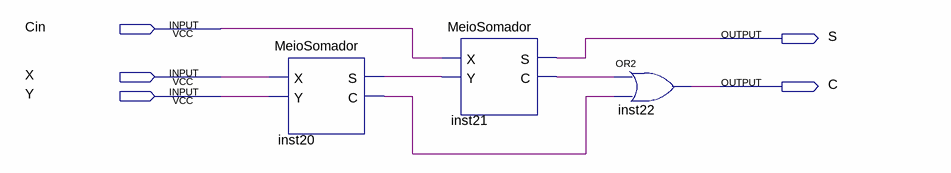
[diagram p0: schematic sheet]
// Quartus schematic SomadorCompleto.bdf as structural Verilog: 3 symbols, 5 pins
module SomadorCompleto (
  input  Cin,
  input  X,
  input  Y,
  output S,
  output C
);

  wire inst20_c, inst20_s, inst21_c;

  MeioSomador inst20 (.X(X), .Y(Y), .S(inst20_s), .C(inst20_c));
  MeioSomador inst21 (.X(Cin), .Y(inst20_s), .S(S), .C(inst21_c));
  or inst22 (C, inst21_c, inst20_c);
endmodule
